# EAGLE design pc_max86150_breakout_qwiic_v1_3 (EAGLE 9.5.2)
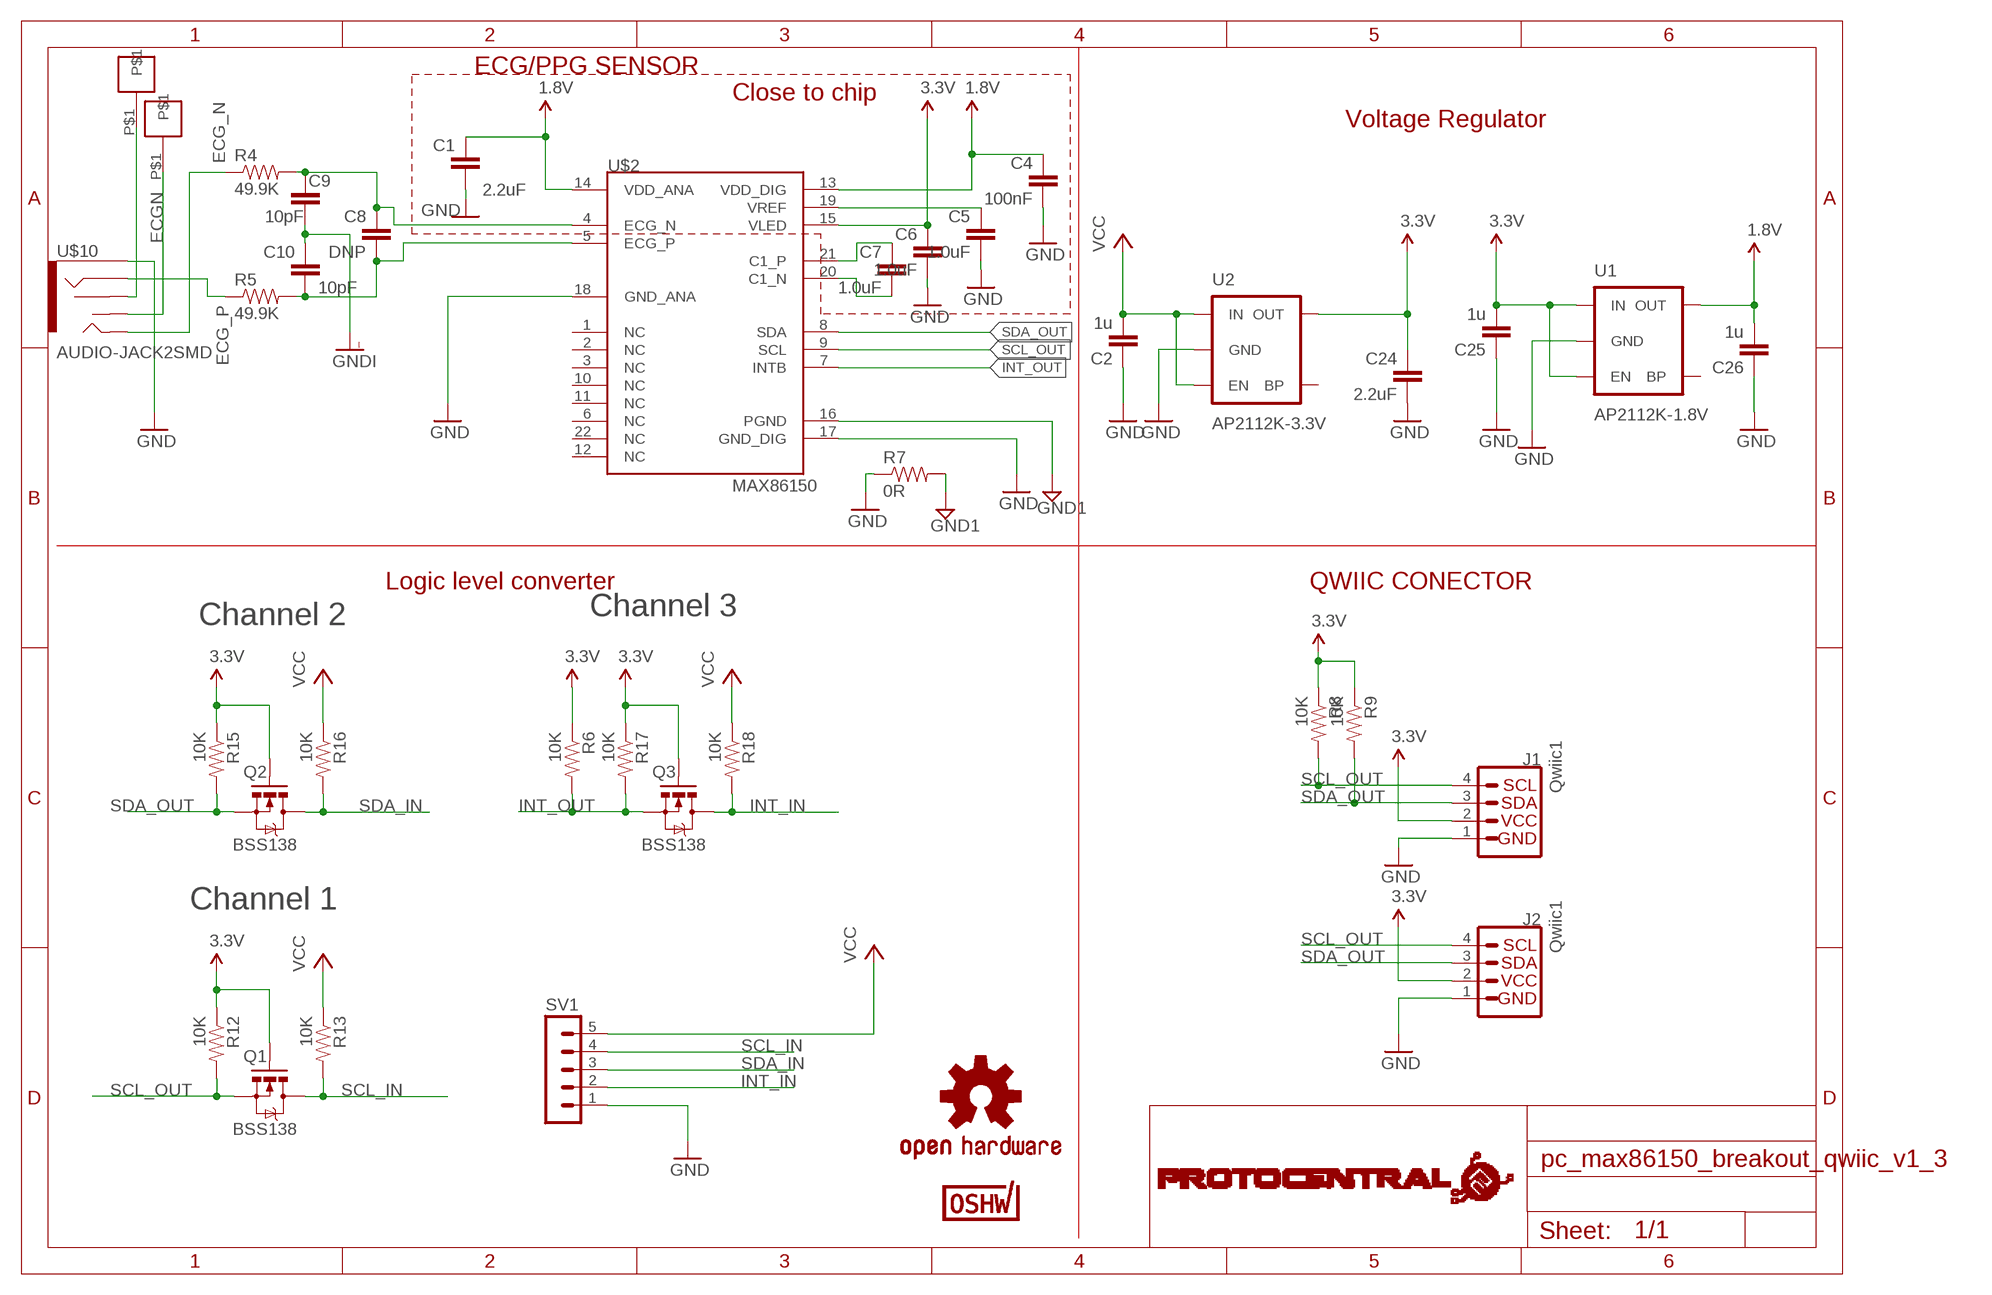
[diagram p0: schematic, sheet 1]

## Parts
C1  2.2uF  1.0UF-0402-16V-10%  [0402]
C2  1u  C-EUC0402  [C0402]
C4  100nF  1.0UF-0402-16V-10%  [0402]
C5  1.0uF  1.0UF-0402-16V-10%  [0402]
C6  1.0uF  1.0UF-0402-16V-10%  [0402]
C7  1.0uF  1.0UF-0402-16V-10%  [0402]
C8  DNP  1.0UF-0402-16V-10%  [0402]
C9  10pF  1.0UF-0402-16V-10%  [0402]
C10  10pF  1.0UF-0402-16V-10%  [0402]
C24  2.2uF  C-EUC0402  [C0402]
C25  1u  C-EUC0402  [C0402]
C26  1u  C-EUC0402  [C0402]
J1  Qwiic1  QWIIC_CONNECTORJS-1MM  [1X04_1MM_RA]
J2  Qwiic1  QWIIC_CONNECTORJS-1MM  [1X04_1MM_RA]
Q1  BSS138  MOSFET-NCHANNELSMD  [SOT23-3]
Q2  BSS138  MOSFET-NCHANNELSMD  [SOT23-3]
Q3  BSS138  MOSFET-NCHANNELSMD  [SOT23-3]
R4  49.9K  RESISTOR0402-RES  [0402-RES]
R5  49.9K  RESISTOR0402-RES  [0402-RES]
R6  10K  RESISTOR0402-RES  [0402-RES]
R7  0R  RESISTOR0402-RES  [0402-RES]
R8  10K  RESISTOR0402-RES  [0402-RES]
R9  10K  RESISTOR0402-RES  [0402-RES]
R12  10K  RESISTOR0402-RES  [0402-RES]
R13  10K  RESISTOR0402-RES  [0402-RES]
R15  10K  RESISTOR0402-RES  [0402-RES]
R16  10K  RESISTOR0402-RES  [0402-RES]
R17  10K  RESISTOR0402-RES  [0402-RES]
R18  10K  RESISTOR0402-RES  [0402-RES]
SV1  MA05-1  [MA05-1]
U1  AP2112K-1.8V  V_REG_LDOSMD  [SOT23-5]
U2  AP2112K-3.3V  V_REG_LDOSMD  [SOT23-5]
U$2  MAX86150  [MAX86150]
U$3  PROTY_LOGO_WITH_TEXT  [PROTY_WITH_TEXT]
U$4  ECG_PAD  [ECG_PAD1]
U$10  AUDIO-JACK2SMD  [AUDIO-JACK-3.5MM-SMD]
U$12  OSHW-LOGOM  [OSHW-LOGO-M]
U$13  ECG_PAD  [ECG_PAD1]
U$17  CERT-SMALL  [CERT-SMALL-SILK]

## Nets
1.8V: C1.1 C4.1 C26.2 U1.5(OUT) U$2.13(VDD_DIG) U$2.14(VDD_ANA)
3.3V: C6.1 C24.1 C25.2 J1.2 J2.2 Q1.1(G) Q2.1(G) Q3.1(G) R6.1 R8.1 R9.1 R12.1 R15.1 R17.1 U1.1(IN) U1.3(EN) U2.5(OUT) U$2.15(VLED)
@: U$4.P$1 U$10.RSH
ECG_N: R4.1 U$10.TIP
ECG_P: R5.1 U$10.RING
ECGN: U$10.TSH U$13.P$1
GND: C1.2 C2.1 C4.2 C5.2 C6.2 C24.2 C25.1 C26.1 J1.1 J2.1 R7.1 SV1.1 U1.2(GND) U2.2(GND) U$2.17(GND_DIG) U$2.18(GND_ANA) U$10.SLEEVE
GND1: R7.2 U$2.16(PGND)
GNDI: C9.2 C10.1
INT_IN: Q3.3(D) R18.2 SV1.2
INT_OUT: Q3.2(S) R6.2 R17.2 U$2.7(INTB)
N$1: C7.1 U$2.21(C1_P)
N$2: C7.2 U$2.20(C1_N)
N$3: C8.1 C9.1 R4.2 U$2.4(ECG_N)
N$4: C5.1 U$2.19(VREF)
N$5: C8.2 C10.2 R5.2 U$2.5(ECG_P)
SCL_IN: Q1.3(D) R13.2 SV1.4
SCL_OUT: J1.4 J2.4 Q1.2(S) R8.2 R12.2 U$2.9(SCL)
SDA_IN: Q2.3(D) R16.2 SV1.3
SDA_OUT: J1.3 J2.3 Q2.2(S) R9.2 R15.2 U$2.8(SDA)
VCC: C2.2 R13.1 R16.1 R18.1 SV1.5 U2.1(IN) U2.3(EN)
Unconnected: U1.4(BP) U2.4(BP) U$2.1(NC) U$2.2(NC) U$2.3(NC) U$2.6(NC) U$2.10(NC) U$2.11(NC) U$2.12(NC) U$2.22(NC)

## Notes on the sheet
- ECG/PPG SENSOR
- Close to chip
- Voltage Regulator
- Logic level converter | QWIIC CONECTOR
- Channel 2 | Channel 3
- Channel 1

## Library data of the parts
C1 C4 C8-C10 = SparkFun-Capacitors:1.0UF: 1µF ceramic capacitors A capacitor is a passive two-terminal electrical component used to store electrical energy temporarily in an electric field.; PROD_ID: CAP-12417; VALUE: 1.0uF
C2 C24-C26 = rcl:C-EU: CAPACITOR, European symbol
C5-C7 = SparkFun-Capacitors:1.0UF: 1µF ceramic capacitors A capacitor is a passive two-terminal electrical component used to store electrical energy temporarily in an electric field.; PROD_ID: CAP-12417
J1 J2 = SparkFun-Connectors:QWIIC_CONNECTOR: SparkFun I2C Standard Qwiic Connector An SMD 1mm pitch JST connector makes it easy and quick (get it? Qwiic?) to connect I2C devices to each other. The Qwiic system <http://www.sparkfun.com/qwiic> enables fast and solderless connection between popular platforms and various sensors and actuators. We carry 200mm <https://www.sparkfun.com/products/14204>, 100mm <https://www.sparkfun.com/products/14205>, 50mm <https://www.sparkfun.com/products/14206>, and breadboard friendly <https://www.sparkfun.com/products/14207> Qwiic cables. We also offer 10 pcs strips <https://www.sparkfun.com/products/14323> the SMD connectors.; PROD_ID: CONN-13694
Q1-Q3 = SparkFun:MOSFET-NCHANNEL
R4-R9 R12 R13 R15-R18 = SparkFun:RESISTOR: Resistor Basic schematic elements and footprints for 0603, 1206, and PTH resistors.
SV1 = con-lstb:MA05-1: PIN HEADER; OC_FARNELL: unknown; OC_NEWARK: unknown
U1 U2 = SparkFun-PowerIC:V_REG_LDO: Voltage Regulator LDO Standard 150mA LDO voltage regulator in SOT-23 layout. Micrel part MIC5205. BP (by-pass) pin is used to lower output noise with 470pF cap.; PROD_ID: VREG-12457
U$2 = circuitects:MAX86150
U$3 = circuitects:PROTY_LOGO_WITH_TEXT
U$4 U$13 = circuitects:ECG_PAD
U$10 = SparkFun:AUDIO-JACK2
U$12 = SparkFun:OSHW-LOGO: Open Source Hardware Logo This logo indicates the piece of hardware it is found on incorporates a OSHW license and/or adheres to the definition of open source hardware found here: http://freedomdefined.org/OSHW
U$17 = OSHWA:CERT

## Board
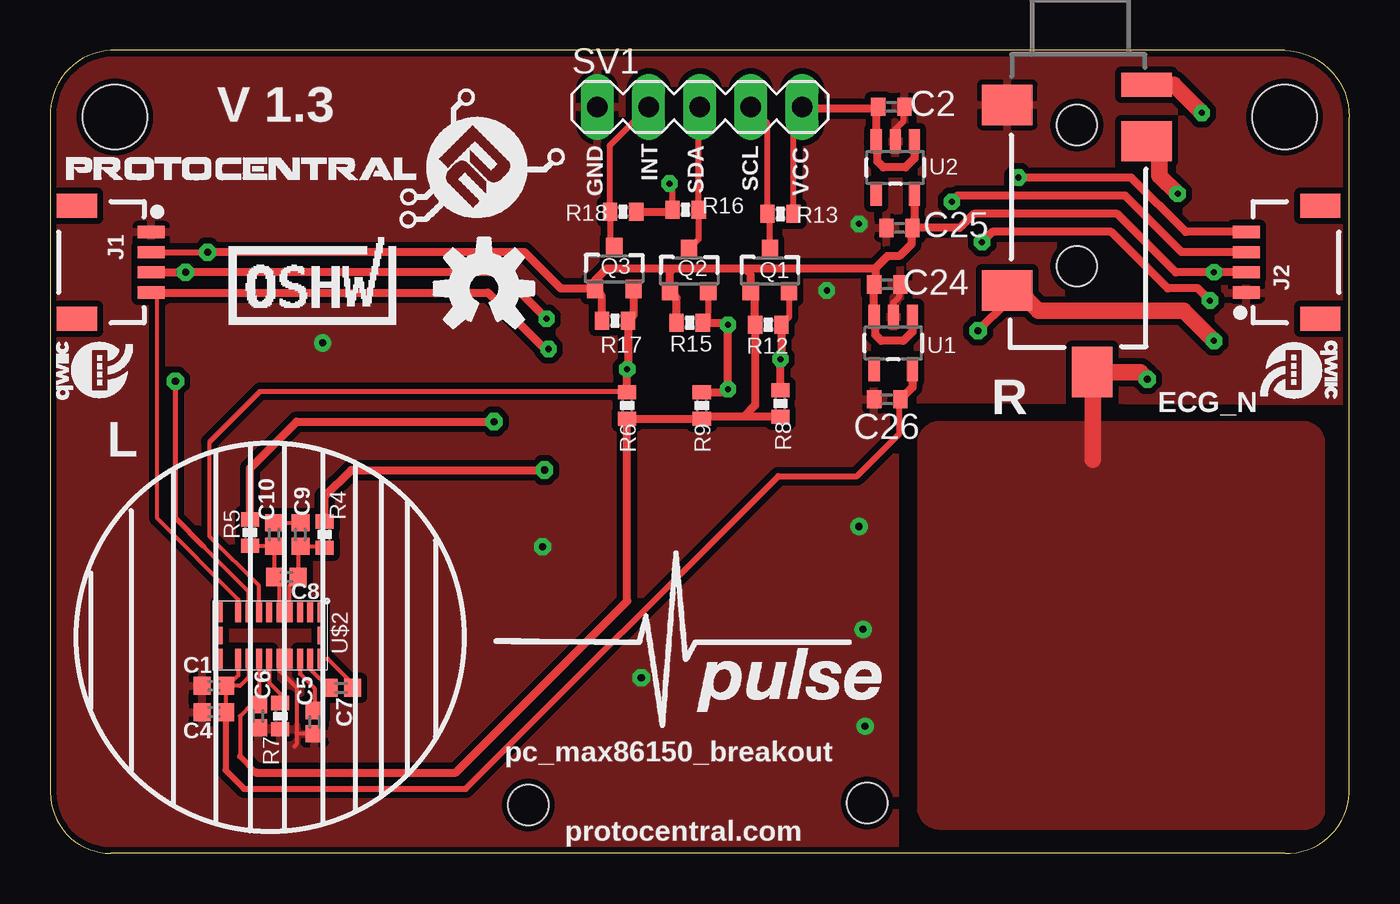
[diagram p1: board, top side]
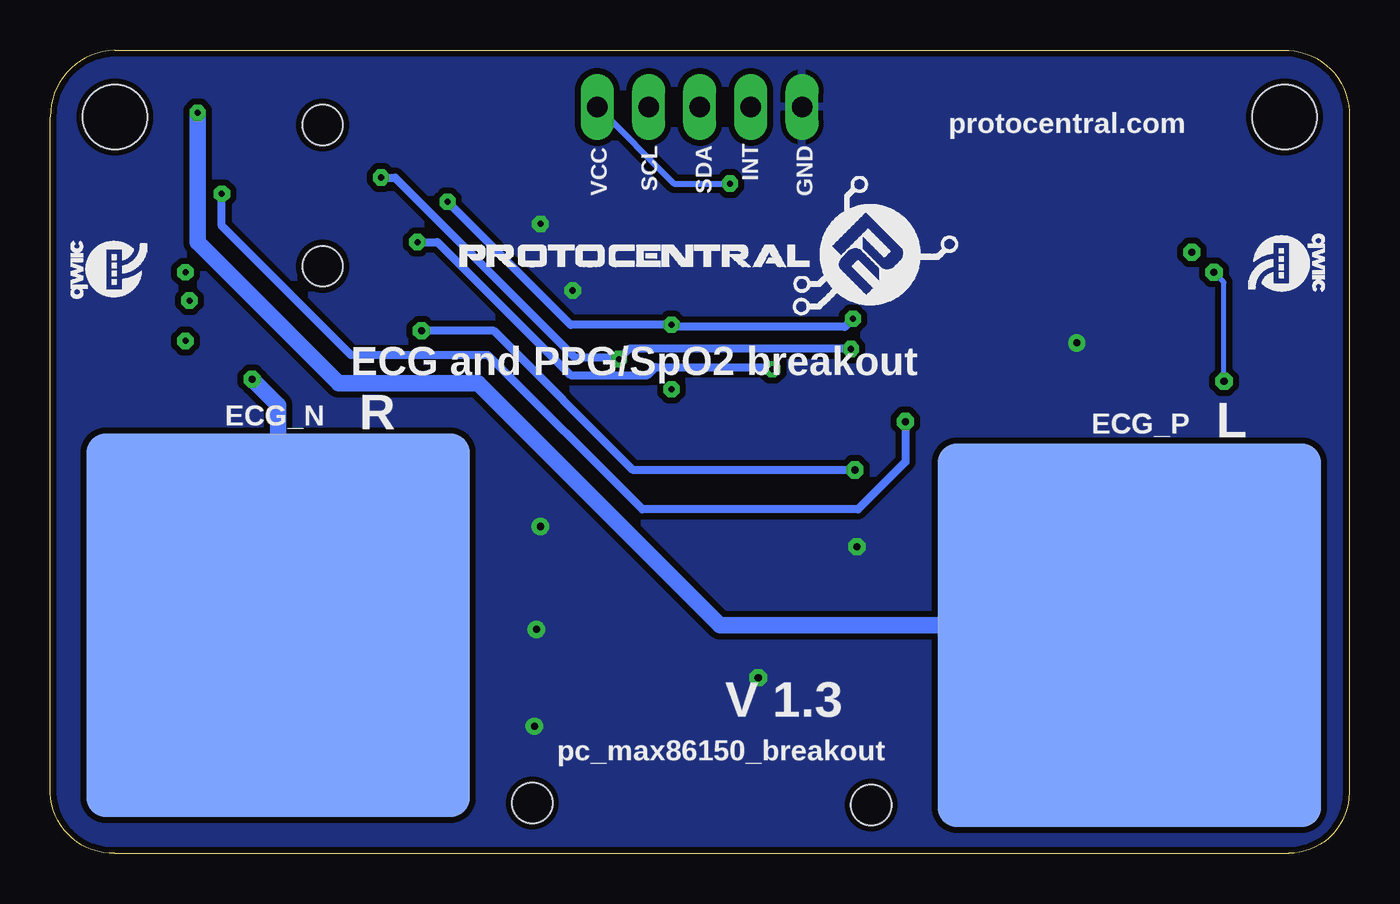
[diagram p2: board, bottom side, seen from below]

Size 64.4 x 39.8 mm. Coordinates in mm from the lower left corner, seen from the top.
Outline: 0,36.5 0,3 arc90 3,0 61.2,0 arc90 64.4,3 64.4,36.5 arc90 61.2,39.8 3,39.8 arc90 0,36.5
Copper layers (1*2*15*16): Top 0.035mm / dielectric 1.5mm / Route2 0.035mm / dielectric 0.15mm / Route15 0.035mm / dielectric 0.2mm / Bottom 0.035mm
Design rules "Circuitects-Rules": minimum track width 6mil, minimum drill 0.3mm, track to track 6mil, track to pad 6mil, pad to pad 6mil, via to via 6mil, smd to smd 6mil, copper to edge 10mil, drill to drill 8mil, minimum pad ring 12mil, minimum via ring 10mil, stop-mask expansion 4mil, vias tented up to drill 25mil, thermal gap 10mil
Holes 3.2 mm at 3.2,36.5 61.2,36.5
Holes 2 mm at 23.7,2.4 40.5,2.5

### Footprints (pad centres in the part's own frame; a part is rotated, then mirrored left to right if it is on the bottom)
0402 = smd 0.85 x 0.9: 1 -0.58,0; 2 0.58,0
C0402 = smd 0.7 x 0.9: 1 -0.65,0; 2 0.65,0
1X04_1MM_RA = smd 0.6 x 1.35: 1 -1.5,0; 2 -0.5,0; 3 0.5,0; 4 1.5,0 | smd 1.2 x 2: NC1 2.8,-3.675; NC2 -2.8,-3.675
SOT23-3 = smd 0.8 x 0.9: 1 -0.95,-1; 2 0.95,-1; 3 0,1.1
0402-RES = smd 0.7 x 0.9: 1 -0.65,0; 2 0.65,0
MA05-1 = drill 1.016 long: 1 -5.08,0; 2 -2.54,0; 3 0,0; 4 2.54,0; 5 5.08,0
SOT23-5 = smd 0.55 x 1.2: 1 -0.95,-1.3; 2 0,-1.3; 3 0.95,-1.3; 4 0.95,1.3; 5 -0.95,1.3
MAX86150 = smd 1 x 0.3: 1 -1.15,2.5; 2 -1.15,1.99; 3 -1.15,1.48; 4 -1.15,0.97; 5 -1.15,0.46; 6 -1.15,-0.05; 7 -1.15,-0.56; 8 -1.15,-1.07; 9 -1.15,-1.58; 10 -1.15,-2.5; 12 1.15,-2.5; 13 1.15,-1.58; 14 1.15,-1.07; 15 1.15,-0.56; 16 1.15,-0.05; 17 1.15,0.46; 18 1.15,0.97; 19 1.15,1.48; 20 1.15,1.99; 21 1.15,2.5 | smd 0.85 x 0.3: 11 0,-2.5; 22 0,2.5
ECG_PAD1 = smd 19 x 19: P$1 0,0
AUDIO-JACK-3.5MM-SMD = smd 2 x 2.5: RING 4.3,3.45; SLEEVE 2.5,-3.45; TIP 11.7,-3.45 | smd 1.2 x 2.5: RSH 1.5,3.45 | smd 2.5 x 2: TSH 15.75,0.75 | hole 2: 3.5,0; 10.5,0

### Placement (x,y rotation side)
C1  8.1,8.3 180 top
C2  41.7,37 180 top
C4  8.1,7 180 top
C5  13.1,6.5 270 top
C6  10.3,6.8 270 top
C7  14.4,8.2 180 top
C8  11.7,13.7 180 top
C9  12.4,15.8 90 top
C10  11.1,15.8 270 top
C24  41.5,28.2 0 top
C25  42.1,31 0 top
C26  41.5,22.5 0 top
J1  5,29.3 270 top
J2  59.3,29.3 90 top
Q1  35.68,28.87 0 top
Q2  31.67,28.87 0 top
Q3  27.96,28.97 0 top
R4  13.6,15.8 270 top
R5  9.9,15.9 270 top
R6  28.6,22.2 90 top
R7  11.4,6.8 90 top
R8  36.2,22.3 90 top
R9  32.3,22.2 90 top
R12  35.6,26.2 0 top
R13  36.2,31.7 180 top
R15  31.7,26.3 0 top
R16  31.5,31.9 0 top
R17  28,26.4 0 top
R18  28.4,31.8 180 top
SV1  32.2,37 0 top
U1  41.8,25.3 180 top
U2  41.9,34 180 top
U$1  PULSE  [PULSE]  21.6,5.7 0 top
U$2  10.9,10.8 270 top
U$3  44.1,27.04 0 bottom
U$4  10.9,10.8 270 bottom
U$6  [QWIIC#LABEL#FULL#M#PNG]  2.19,23.86 90 top
U$7  PROTY_LOGO_WITH_TEXT  [PROTY_WITH_TEXT]  0.8,31.36 0 top
U$9  [QWIIC#LABEL#FULL#M#PNG]  3.11,29.34 270 bottom
U$10  50.9,39.6 270 top
U$11  [QWIIC#LABEL#FULL#M#PNG]  61.49,28.86 90 bottom
U$12  21.5,28 0 top
U$13  53.1,11.3 270 bottom
U$17  13,26.2 0 top
U$59  [QWIIC#LABEL#FULL#M#PNG]  61.91,24.04 270 top

### Tracks (layer width: path | path; a pad name or v marks a point on that pad's centre or on a via)
1.8V
  Top 0.2: 9.83,9.21 U$2.14 9.83,8.73 9.4,8.3 8.8,8.3 | 8.8,8.3 C1.1 C4.1 | U$2.13 9.32,8.82 8.8,8.3 | 42.1,22.25 42,22.35
  Top 0.305: C4.1 8.68,4.12 9.6,3.2 20.6,3.2 36.1,18.7 40,18.7 42.1,20.8 42.1,22.25
  Top 0.406: 42,22.35 C26.2 42.75,23.1 U1.5
3.3V  (via drill 0.3, 0.35)
  Top 0.2: 10.36,7.44 C6.1 9.98,7.38 9.4,6.8 9.4,4.8 | 10.36,7.44 10.4,7.48 | U$2.15 10.34,7.46 10.36,7.44
  Top 0.305: J1.2 v7.8,29.8 | 9.4,4.8 10.2,4
  Top 0.406: Q3.1 26.98,28 25.3,28 23.5,29.8 v7.8,29.8 | U2.5 42.85,31.1 C25.2 | U1.1 42.75,25.85 42.3,25.4 41.2,25.4 40.9,25.7 40.9,26.55 U1.3 C24.1 40.9,28.25 40.9,29 | Q3.1 27.01,28.41 27.6,29 30.9,29 | C25.2 42.7,30.95 42.7,30.2 42.1,29.6 41.5,29.6 40.9,29 | 30.9,29 30.72,28.82 Q2.1 31.05,27.54 R15.1 | R17.1 27.35,27.63 Q3.1 | 30.9,29 34.4,29 | 34.4,29 40.9,29 | 34.4,29 34.73,28.67 Q1.1 34.95,27.65 R12.1 34.95,22.2 34.4,21.65 | J2.2 v57.7,28.8 55.8,28.8 52.9,31.7 45.8,31.7 45.1,31 C25.2 | R8.1 34.4,21.65 | 34.4,21.65 32.4,21.65 R9.1 R6.1 28.6,12.5 20.1,4 10.2,4
@  (via drill 0.3)
  Top 0.813: U$10.RSH 55.7,38.1 v57.1,36.7
  Bottom 0.813: v57.1,36.7 57.1,30.3 50.1,23.3 43.2,23.3 31.2,11.3 11.4,11.3 U$4.P$1
ECG_N  (via drill 0.3, 0.35)
  Top 0.406: 47.7,27.9 U$10.TIP 47.45,27.35 v46,25.9 | R4.1 13.6,17.7 14.9,19 v24.5,19
  Top 0.813: 47.7,27.9 48,27.9 49,26.9 56.2,26.9 v57.7,25.4
  Bottom 0.406: v46,25.9 42.4,25.9 35.5,19 v24.5,19
ECG_P  (via drill 0.3, 0.35)
  Top 0.406: U$10.RING 55,35.3 | R5.1 9.9,19.1 12.2,21.4 v22,21.4
  Top 0.813: 55,35.3 55,33.6 v55.9,32.7
  Bottom 0.406: v55.9,32.7 55.9,31.1 49.5,24.7 42.7,24.7 35.05,17.05 24.35,17.05 22,19.4 v22,21.4
ECGN  (via drill 0.35)
  Top 0.813: 51.7,19.5 51.7,23.85 U$10.TSH 54.05,23.85 v54.4,23.5
  Bottom 0.813: U$13.P$1 53.1,22.2 v54.4,23.5
  pour Top: 43.1,20.3 43.1,2.3 arc90 44.1,1.3 62.2,1.3 arc90 63.1,2.2 63.1,20.3 arc90 62.1,21.3 44.1,21.3 arc90
GND  (via drill 0.3, 0.35)
  Top 0.2: U$2.17 11.36,9.04 12.2,8.2 12.2,6 | 12.2,6 12.2,5.4 12.1,5.3 | C5.2 12.28,5.92 12.2,6
  Top 0.305: U2.2 41.9,35.9 42.3,36.3 42.3,36.95 C2.1 | U1.2 41.8,27.3 42.1,27.6 42.1,28.15 C24.2
  other vias: 40.1,31.2 38.5,27.9 29.3,8.7 24.4,15.2 13.5,25.3 40.1,16.2 40.3,11.1 40.4,6.3
  pour Top (isolate 0.305, rank 3): -0.4,40 -0.4,0 41.9,0.1 41.9,22.5 64.6,22.4 64.6,40
  pour Bottom (isolate 0.305): -0.4,40 -0.4,0 64.6,0 64.6,40
GND1
  Top 0.2: U$2.16 10.85,8.45 11.4,7.9 R7.2
GNDI
  Top 0.2: C10.1 C9.2
INT_IN
  Top 0.305: SV1.2 27.75,35.09 R18.2 27.75,30.28 Q3.3
INT_OUT  (via drill 0.3)
  Top 0.2: U$2.7 10.34,13.26 7.9,15.7 7.9,20.4 | 27.6,22.9 28.5,22.9 28.55,22.9 R6.2
  Top 0.254: 7.9,20.4 10.4,22.9 28.5,22.9
  Top 0.406: Q3.2 28.91,26.66 R17.2 28.65,24.05 v28.6,24 R6.2 | v57.5,27.4 56.9,28 55.4,28 52.6,30.8 46.7,30.8 v46.2,30.3
  Bottom 0.406: v46.2,30.3 45.2,30.3 38.6,23.7 34.8,23.7 34.4,24.1 28.7,24.1 v28.6,24
N$1
  Top 0.2: U$2.21 13.75,9.65 14.8,8.6 14.8,8.38 C7.1
N$2
  Top 0.2: U$2.20 12.89,9.13 C7.2
N$3
  Top 0.2: U$2.4 11.87,13.29 C8.1 12.28,15.1 C9.1 13.53,15.22 R4.2
N$4
  Top 0.2: U$2.19 12.38,8.9 13.1,8.18 C5.1
N$5
  Top 0.2: U$2.5 11.36,13.46 C8.2 11.12,15.2 C10.2 9.93,15.22 R5.2
SCL_IN
  Top 0.305: Q1.3 35.68,31.57 R13.2 35.55,36.19 SV1.4
SCL_OUT  (via drill 0.3)
  Top 0.2: U$2.9 9.32,12.58 5.3,16.6 5.3,27.8
  Top 0.305: Q1.2 36.63,26.58 R12.2
  Top 0.406: J1.4 5.3,27.8 21.7,27.8 24.5,25 v24.7,25 | R8.2 v36.2,24.5 36.25,24.55 R12.2 | J2.4 56.3,30.8 53.6,33.5 v48,33.5
  Bottom 0.406: v24.7,25 35.7,25 v36.2,24.5 36.3,24.6 38.4,24.6 47.3,33.5 v48,33.5
SDA_IN
  Top 0.305: SV1.3 32.15,36.95 R16.2 32.15,30.45 Q2.3
SDA_OUT  (via drill 0.3, 0.35)
  Top 0.2: U$2.8 9.83,12.97 7.6,15.2
  Top 0.254: 7.6,15.2 6.2,16.6 v6.2,23.4
  Top 0.305: Q2.2 32.62,26.57 R15.2
  Top 0.406: v24.6,26.5 22.3,28.8 v6.7,28.8 J1.3 | R15.2 33.5,26.3 v33.6,26.2 v33.6,23 33.45,22.85 R9.2 | J2.3 56.1,29.8 53.3,32.6 45,32.6 v44.7,32.3
  Bottom 0.254: v6.2,23.4 6.2,28.3 v6.7,28.8
  Bottom 0.406: v24.6,26.5 25,26.1 33.5,26.1 v33.6,26.2 38.6,26.2 v44.7,32.3
VCC  (via drill 0.3)
  Top 0.305: R13.1 36.85,36.57 SV1.5 | R16.1 30.85,33.05 v30.7,33.2
  Top 0.406: R18.1 30.75,31.8 R16.1 | 40.85,35.2 U2.3 | U2.3 40.95,36.9 | 40.95,36.9 C2.2 | U2.1 42.85,34.45 42.4,34 41.3,34 41,34.3 41,35.25 U2.3 | 40.95,36.9 37.38,36.9 SV1.5
  Bottom 0.305: SV1.5 33.48,33.2 v30.7,33.2

### Text on the board
tPlace: V 1.3 | GND | INT | SDA | SCL | VCC | R | ECG_N | L | pc_max86150_breakout | protocentral.com
bPlace: protocentral.com | GND | INT | SDA | SCL | VCC | ECG and PPG/SpO2 breakout | ECG_P | ECG_N | R | L | V 1.3 | pc_max86150_breakout
_tNames: SV1 | SV1 | C2 | C2 | U2 | U2 | R18 | R18 | R13 | R13 | R16 | R16 | J1 | J1 | C25 | C25 | Q3 | Q3 | Q2 | Q2 | C24 | C24 | Q1 | Q1 | J2 | J2 | R17 | R17 | R15 | R15 | R12 | R12 | U1 | U1 | C26 | C26 | R6 | R6 | R9 | R9 | R8 | R8 | R5 | C9 | C10 | R4 | C8 | U$2 | C1 | C6 | C7 | C4 | R7 | C5
_bNames: R5 | C9 | C10 | R4 | C8 | U$2 | C1 | C6 | C7 | C4 | R7 | C5